# Altium schematic sheet Master MicroController.SchDoc: Master Micro Controller
size 393 x 281 mm; DocumentNumber: 13; SheetNumber: 16; SheetTotal: 44
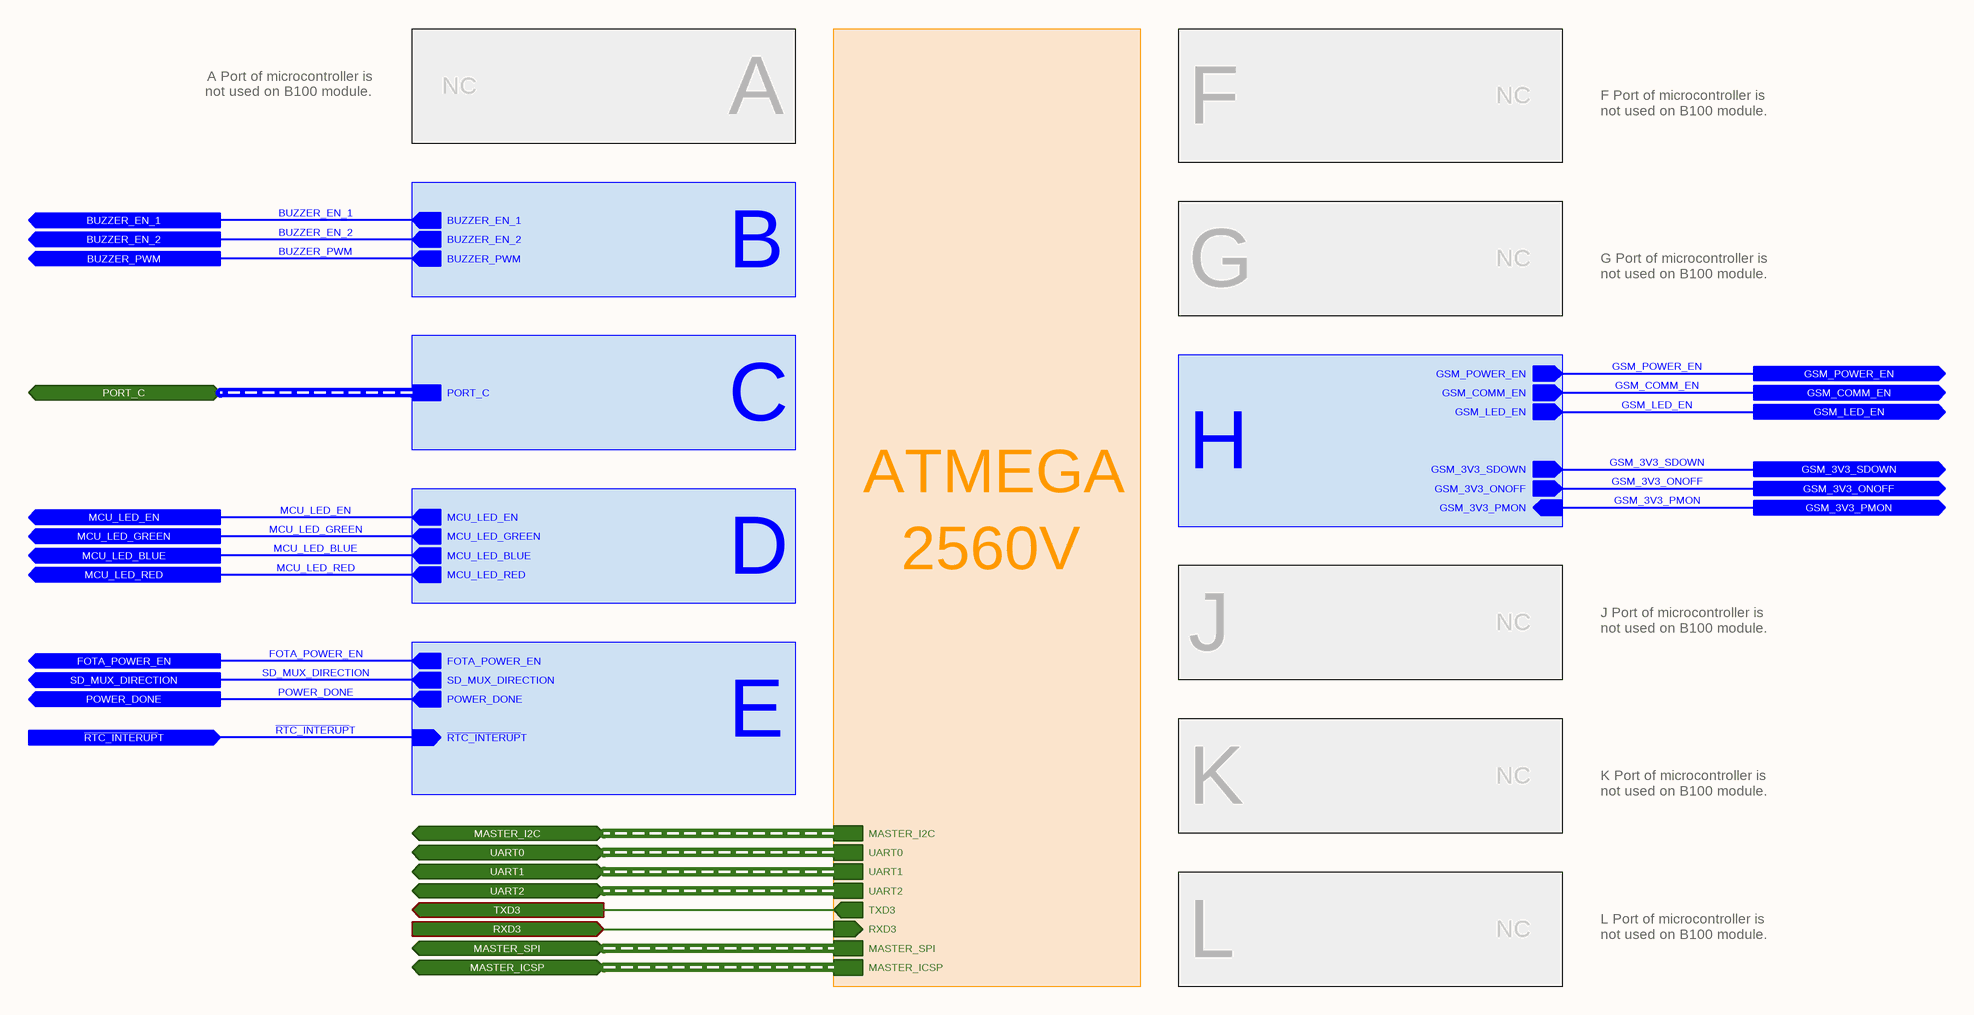
[diagram p0: Master MicroController.SchDoc]

## Sub-sheets
Master MicroController Core = Master MicroController Core.SchDoc: MASTER_I2C (harness MASTER_I2C), MASTER_SPI (harness MASTER_SPI), UART0 (harness UART0), UART1 (harness UART1), UART2 (harness UART2), MASTER_ICSP (harness MASTER_ICSP), TXD3 (out), RXD3 (in)
PORT A = Master MicroController Port A.SchDoc: no entries
PORT B = Master MicroController Port B.SchDoc: BUZZER_EN_2 (out), BUZZER_EN_1 (out), BUZZER_PWM (out)
PORT C = Master MicroController Port C.SchDoc: PORT_C (harness PORT_C)
PORT D = Master MicroController Port D.SchDoc: MCU_LED_EN (out), MCU_LED_GREEN (out), MCU_LED_BLUE (out), MCU_LED_RED (out)
PORT E = Master MicroController Port E.SchDoc: FOTA_POWER_EN (out), SD_MUX_DIRECTION (out), ~{RTC_INTERUP}T (in), POWER_DONE (out)
PORT F = Master MicroController Port F.SchDoc: no entries
PORT G = Master MicroController Port G.SchDoc: no entries
PORT H = Master MicroController Port H.SchDoc: GSM_POWER_EN (out), GSM_3V3_SDOWN (out), GSM_COMM_EN (out), GSM_LED_EN (out), GSM_3V3_ONOFF (out), GSM_3V3_PMON (in)
PORT J = Master MicroController Port J.SchDoc: no entries
PORT K = Master MicroController Port K.SchDoc: no entries
PORT L = Master MicroController Port L.SchDoc: no entries

## Ports
BUZZER_EN_1 (out), BUZZER_EN_2 (out), BUZZER_PWM (out), FOTA_POWER_EN (out), GSM_3V3_ONOFF (out), GSM_3V3_PMON (out), GSM_3V3_SDOWN (out), GSM_COMM_EN (out), GSM_LED_EN (out), GSM_POWER_EN (out), MASTER_I2C (bidir, harness MASTER_I2C), MASTER_ICSP (bidir, harness MASTER_ICSP), MASTER_SPI (bidir, harness MASTER_SPI), MCU_LED_BLUE (out), MCU_LED_EN (out), MCU_LED_GREEN (out), MCU_LED_RED (out), PORT_C (bidir, harness PORT_C), POWER_DONE (out), RXD3 (in), SD_MUX_DIRECTION (out), TXD3 (out), UART0 (bidir, harness UART0), UART1 (bidir, harness UART1), UART2 (bidir, harness UART2), ~{RTC_INTERUP}T (in)

## Nets
~{RTC_INTERUP}T: port ~{RTC_INTERUP}T, sheet PORT E/~{RTC_INTERUP}T
BUZZER_EN_1: port BUZZER_EN_1, sheet PORT B/BUZZER_EN_1
BUZZER_EN_2: port BUZZER_EN_2, sheet PORT B/BUZZER_EN_2
BUZZER_PWM: port BUZZER_PWM, sheet PORT B/BUZZER_PWM
FOTA_POWER_EN: port FOTA_POWER_EN, sheet PORT E/FOTA_POWER_EN
GSM_3V3_ONOFF: port GSM_3V3_ONOFF, sheet PORT H/GSM_3V3_ONOFF
GSM_3V3_PMON: port GSM_3V3_PMON, sheet PORT H/GSM_3V3_PMON
GSM_3V3_SDOWN: port GSM_3V3_SDOWN, sheet PORT H/GSM_3V3_SDOWN
GSM_COMM_EN: port GSM_COMM_EN, sheet PORT H/GSM_COMM_EN
GSM_LED_EN: port GSM_LED_EN, sheet PORT H/GSM_LED_EN
GSM_POWER_EN: port GSM_POWER_EN, sheet PORT H/GSM_POWER_EN
MCU_LED_BLUE: port MCU_LED_BLUE, sheet PORT D/MCU_LED_BLUE
MCU_LED_EN: port MCU_LED_EN, sheet PORT D/MCU_LED_EN
MCU_LED_GREEN: port MCU_LED_GREEN, sheet PORT D/MCU_LED_GREEN
MCU_LED_RED: port MCU_LED_RED, sheet PORT D/MCU_LED_RED
POWER_DONE: port POWER_DONE, sheet PORT E/POWER_DONE
RXD3: port RXD3, sheet Master MicroController Core/RXD3
SD_MUX_DIRECTION: port SD_MUX_DIRECTION, sheet PORT E/SD_MUX_DIRECTION
TXD3: port TXD3, sheet Master MicroController Core/TXD3

## Buses and harness runs
harness port MASTER_I2C = sheet Master MicroController Core/MASTER_I2C
harness port MASTER_ICSP = sheet Master MicroController Core/MASTER_ICSP
harness port MASTER_SPI = sheet Master MicroController Core/MASTER_SPI
harness port PORT_C = sheet PORT C/PORT_C
harness port UART0 = sheet Master MicroController Core/UART0
harness port UART1 = sheet Master MicroController Core/UART1
harness port UART2 = sheet Master MicroController Core/UART2

## Notes on the sheet
- A Port of microcontroller is not used on B100 module.
- NC
- A
- F
- F Port of microcontroller is not used on B100 module.
- B
- G
- G Port of microcontroller is not used on B100 module.
- C
- ATMEGA
- H
- D
- 2560V
- J Port of microcontroller is not used on B100 module.
- J
- E
- K
- K Port of microcontroller is not used on B100 module.
- L
- L Port of microcontroller is not used on B100 module.
- © 2021 All rights reserved.
  This document may not, in whole or in part, be copied, photocopied, reproduced, translated or converted to any electronic or machine readable from without prior written permission of Mehmet Günce Akkoyun.
  Engineer contact : akkoyun@me.com
- Property of
- Engineer :
- Date :
- Size :
- A3
- Time :
- Project :
- Page :
- /
- Customer :
- Product ID :
- Module ID :
- Version :
- File :
- Revision :